# EasyEDA Pro project wifi_smart_controller.eprj

# Schematic 控制版原理图
Create Date: 2023-10-15; Page Name: P1; Project Name: smart-switch; Schematic Name: 控制版原理图; Update Date: 2023-10-21; Company: WiFi控制版; Page Size: A4; Version: V1.0
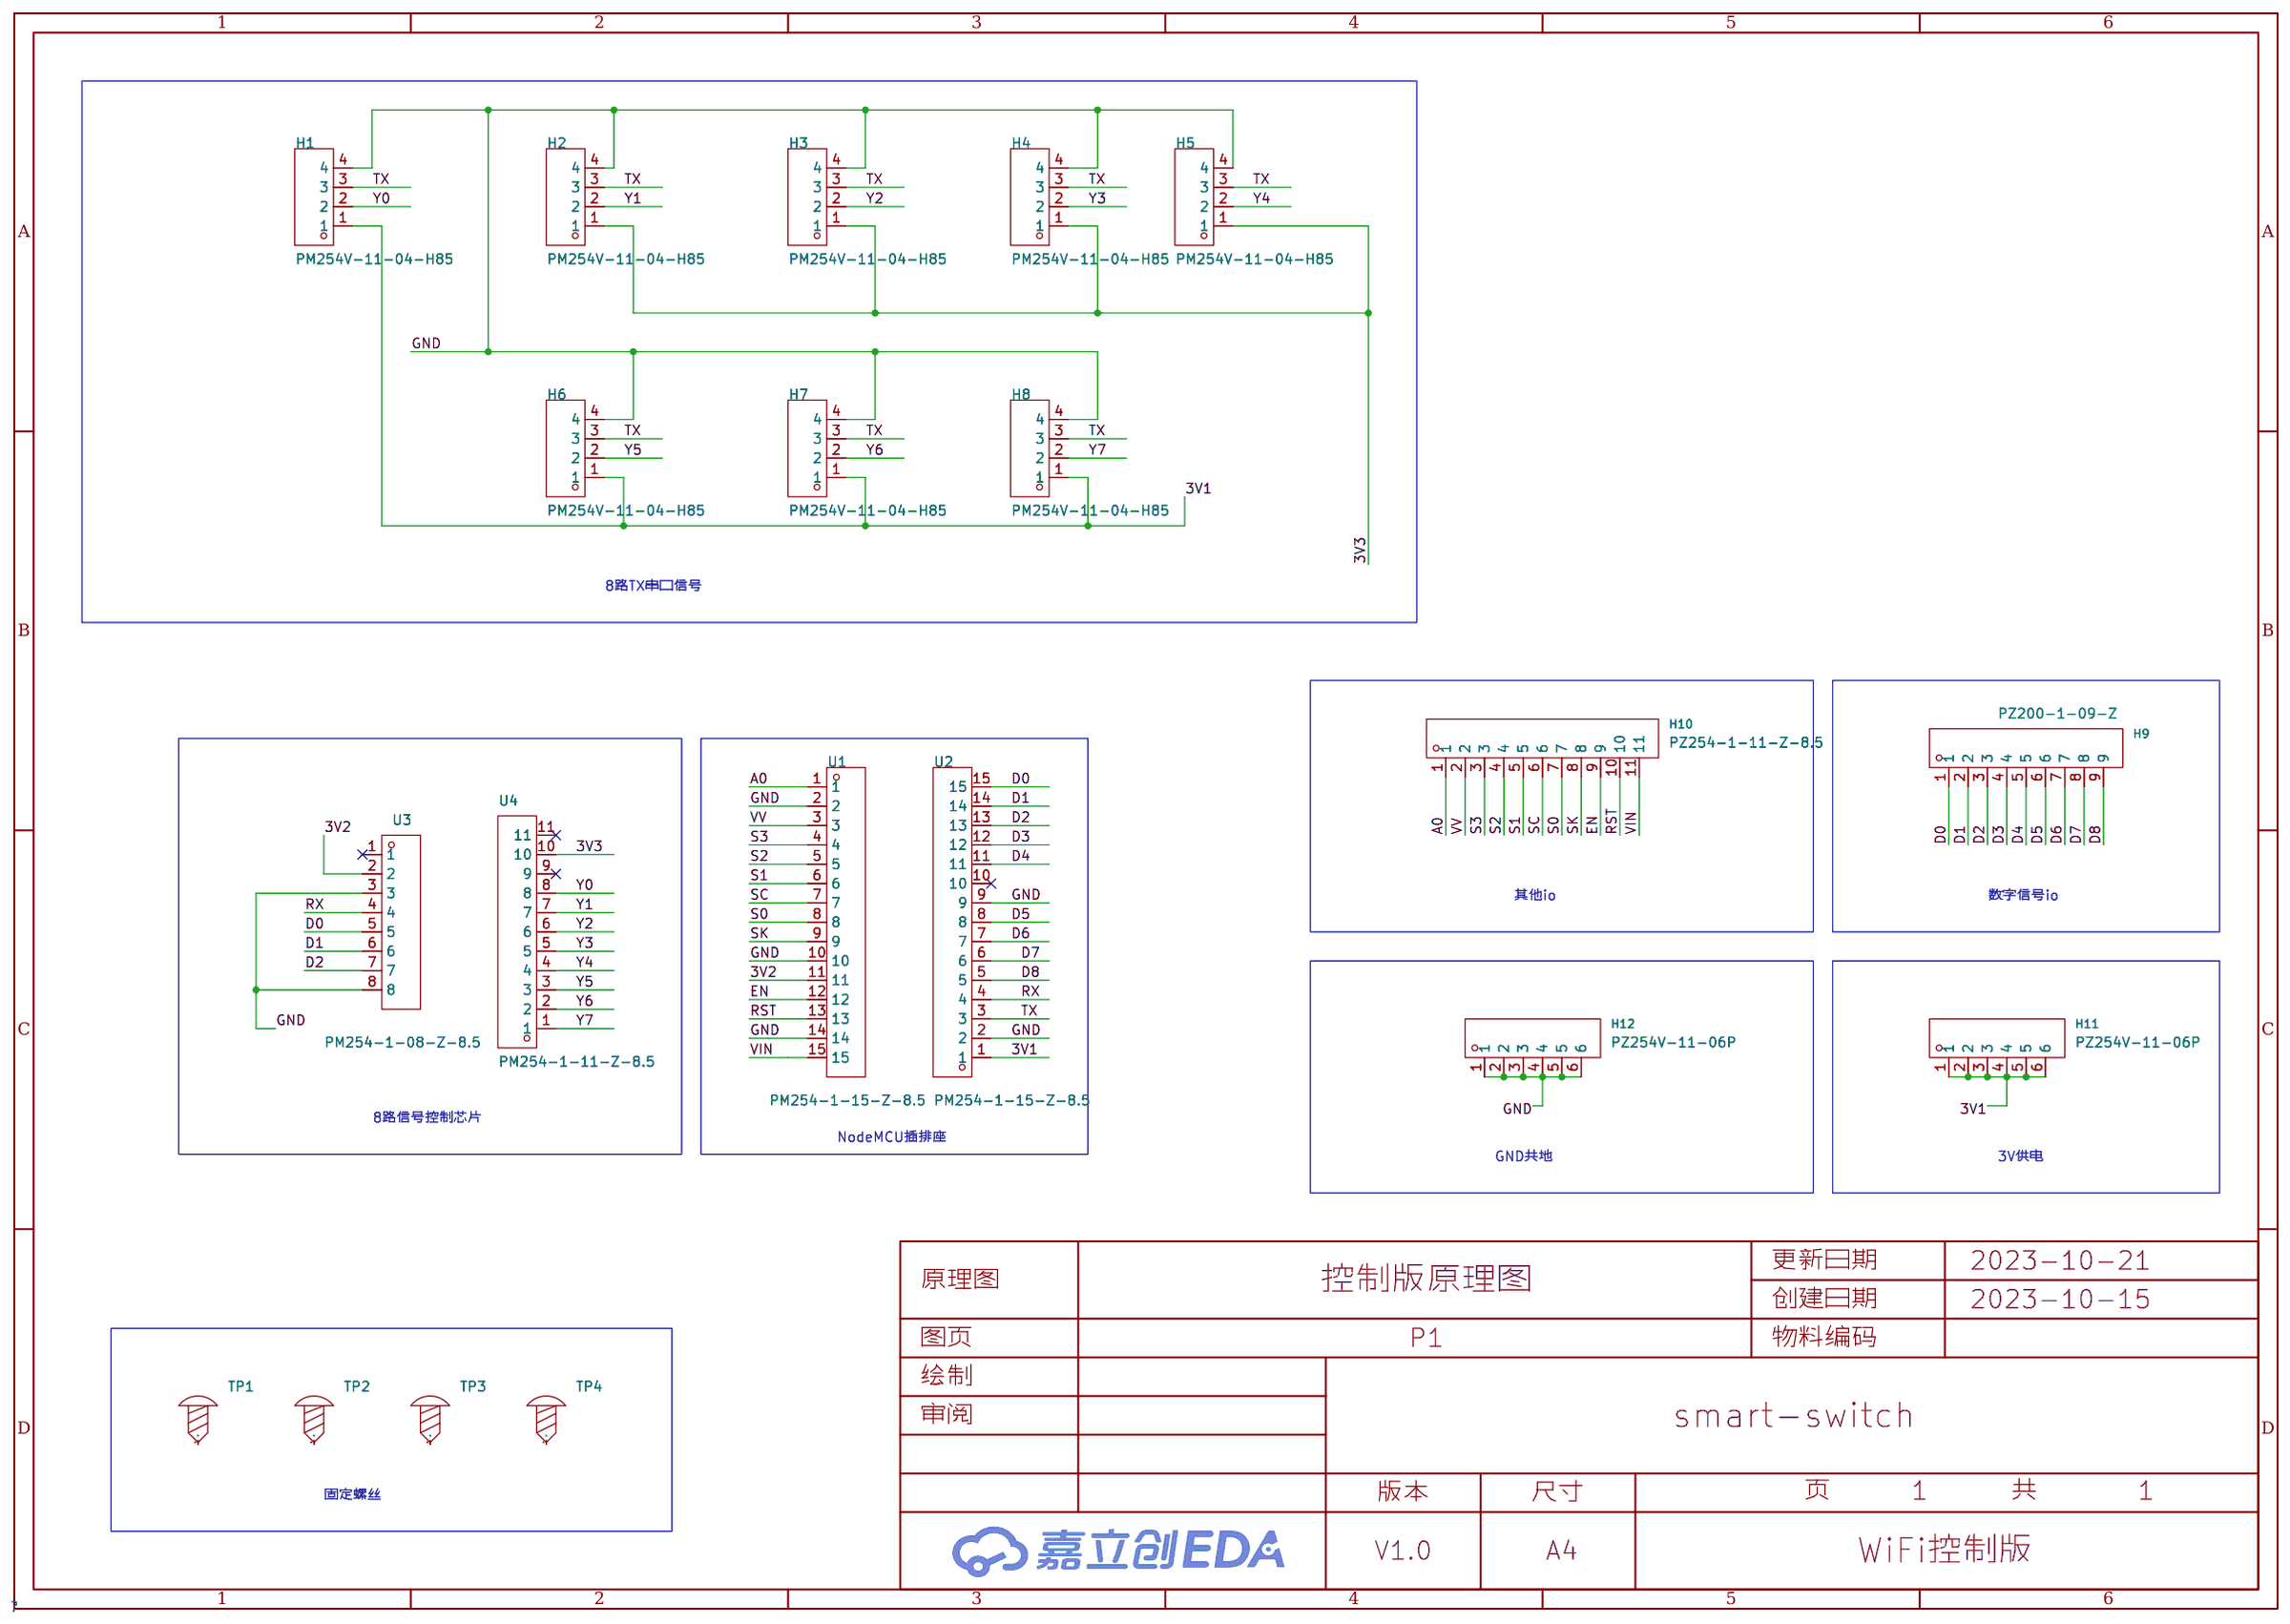
[diagram p0: schematic sheet]

## Parts
H1  PM254V-11-04-H85  [HDR-TH_4P-P2.54-V-F]
H2  PM254V-11-04-H85  [HDR-TH_4P-P2.54-V-F]
H3  PM254V-11-04-H85  [HDR-TH_4P-P2.54-V-F]
H4  PM254V-11-04-H85  [HDR-TH_4P-P2.54-V-F]
H5  PM254V-11-04-H85  [HDR-TH_4P-P2.54-V-F]
H6  PM254V-11-04-H85  [HDR-TH_4P-P2.54-V-F]
H7  PM254V-11-04-H85  [HDR-TH_4P-P2.54-V-F]
H8  PM254V-11-04-H85  [HDR-TH_4P-P2.54-V-F]
H9  PZ200-1-09-Z  [HDR-TH_9P-P2.00-V-M]
H10  PZ254-1-11-Z-8.5  [HDR-TH_11P-P2.54-V-M]
H11  PZ254V-11-06P  [HDR-TH_6P-P2.54-V-M]
H12  PZ254V-11-06P  [HDR-TH_6P-P2.54-V-M]
TP1  -  [M2螺丝]
TP2  -  [M2螺丝]
TP3  -  [M2螺丝]
TP4  -  [M2螺丝]
U1  PM254-1-15-Z-8.5  [HDR-TH_15P-P2.54-V-F]
U2  PM254-1-15-Z-8.5  [HDR-TH_15P-P2.54-V-F]
U3  PM254-1-08-Z-8.5  [HDR-TH_8P-P2.54-V-F]
U4  PM254-1-11-Z-8.5  [HDR-TH_11P-P2.54-V-F]

## Library data of the parts
H1-H8 = PM254V-11-04-H85: 排数:单排;总孔位数:4P;间距:2.54mm;插孔结构:1x4P;行距:-;安装类型:直插;塑高:-;触头材质:黄铜;触头镀层:-;; LCSC Part Name: 间距:2.54mm 1x4P 直插; Supplier Part: C541851; Manufacturer: XFCN(兴飞); Supplier Footprint: 插件,P=2.54mm; JLCPCB Part Class: 扩展库; Datasheet: https://atta.szlcsc.com/upload/public/pdf/source/20200518/C541849_85853D71FC67C51915A806977A588FDA.pdf; Supplier: LCSC; Number of Rows: 单排; Number of Holes: 4P; Pitch: 2.54mm; Holes Structure: 1x4P; Mounting Type: 直插; Contact Material: 黄铜
H9 = PZ200-1-09-Z: 排数:单排;总PIN位数:9P;间距:2mm;插针结构:1x9P;行距:-;安装类型:直插;圆针/方针:方针;额定电流:1.5A;额定电压:-;配合针长度:4mm;塑高:2mm;端接针长度:2.8mm;工作温度范围:-40℃~+105℃;颜色:黑色;; LCSC Part Name: 2mm 1x9P 直插 方针; Supplier Part: C2905955; Manufacturer: HCTL(华灿天禄); Supplier Footprint: 插件,P=2mm; JLCPCB Part Class: 扩展库; Datasheet: https://atta.szlcsc.com/upload/public/pdf/source/20230609/0DA0371628951EEB327252501352EB23.pdf; Supplier: LCSC; Number of Rows: 单排; Number of Pins: 9P; Pitch: 2mm; Pin Structure: 1x9P; Mounting Type: 直插; Circluar Pins/Square Pins: 方针; Current Rating (Max): 1.5A; Length of Mating Pin: 4mm; Insulation Height: 2mm; Length of End Connection Pin: 2.8mm; Operating Temperature Range: -40℃~+105℃; Color: 黑色
H10 = PZ254-1-11-Z-8.5: 排数:单排;总PIN位数:11;间距:2.54mm;插针结构:1x11P;行距:-;安装类型:直插;圆针/方针:方针;额定电流:3A;额定电压:-;配合针长度:6mm;塑高:2.5mm;端接针长度:3mm;触头材质:-;工作温度范围:-40℃~+105℃;颜色:黑色;; LCSC Part Name: 2.54mm 1x11P 直插 方针; Supplier Part: C2894934; Manufacturer: HCTL(华灿天禄); Supplier Footprint: 直插,P=2.54mm; JLCPCB Part Class: Extended Part; Supplier: LCSC; Number of Rows: 单排; Number of Pins: 11; Pitch: 2.54mm; Pin Structure: 1x11P; Mounting Type: 直插; Circluar Pins/Square Pins: 方针; Current Rating (Max): 3A; Length of Mating Pin: 6mm; Insulation Height: 2.5mm; Length of End Connection Pin: 3mm; Operating Temperature Range: -40℃~+105℃; Color: 黑色
H11 H12 = PZ254V-11-06P: 排数:单排;总PIN位数:6;间距:2.54mm;插针结构:1x6P;行距:-;安装类型:直插;圆针/方针:方针;额定电流:-;额定电压:-;配合针长度:6mm;塑高:2.5mm;端接针长度:3mm;触头材质:黄铜;触头镀层:-;工作温度范围:-40℃~+105℃;颜色:黑色;; LCSC Part Name: 2.54mm 1x6P 直插 方针; Supplier Part: C492405; Manufacturer: XFCN(兴飞); Supplier Footprint: 直插,P=2.54mm; JLCPCB Part Class: Extended Part; Supplier: LCSC; Number of Rows: 单排; Number of Pins: 6; Pitch: 2.54mm; Pin Structure: 1x6P; Mounting Type: 直插; Circluar Pins/Square Pins: 方针; Length of Mating Pin: 6mm; Insulation Height: 2.5mm; Length of End Connection Pin: 3mm; Contact Material: 黄铜; Operating Temperature Range: -40℃~+105℃; Color: 黑色
TP1-TP4 = M2螺丝: Supplier Footprint: 插件
U1 U2 = PM254-1-15-Z-8.5: 排数:单排;总孔位数:15P;间距:2.54mm;插孔结构:1x15P;行距:-;安装类型:直插;圆孔/方孔:方孔;额定电流:3A;额定电压:-;插孔方向:顶部;塑高:8.5mm;工作温度范围:-40℃~+105℃;; LCSC Part Name: 间距:2.54mm 1x15P 直插; Supplier Part: C2897378; Manufacturer: HCTL(华灿天禄); Supplier Footprint: 插件,P=2.54mm; JLCPCB Part Class: 扩展库; Datasheet: https://atta.szlcsc.com/upload/public/pdf/source/20230609/534BE42964C679BDE98E061007C4ABD6.pdf; Supplier: LCSC; Number of Rows: 单排; Number of Holes: 15P; Pitch: 2.54mm; Holes Structure: 1x15P; Mounting Type: 直插; Circular Hole / Square Hole: 方孔; Current Rating (Max): 3A; Holes Direction: 顶部; Insulation Height: 8.5mm; Operating Temperature Range: -40℃~+105℃
U3 = PM254-1-08-Z-8.5: 排数:单排;总孔位数:8P;间距:2.54mm;插孔结构:1x8P;行距:-;安装类型:直插;圆孔/方孔:方孔;额定电流:3A;额定电压:-;插孔方向:顶部;塑高:8.5mm;工作温度范围:-40℃~+105℃;; LCSC Part Name: 间距:2.54mm 1x8P 直插; Supplier Part: C2897371; Manufacturer: HCTL(华灿天禄); Supplier Footprint: 插件,P=2.54mm; JLCPCB Part Class: Extended Part; Datasheet: https://atta.szlcsc.com/upload/public/pdf/source/20230609/534BE42964C679BDE98E061007C4ABD6.pdf; Supplier: LCSC; Number of Rows: 单排; Number of Holes: 8P; Pitch: 2.54mm; Holes Structure: 1x8P; Mounting Type: 直插; Circular Hole / Square Hole: 方孔; Current Rating (Max): 3A; Holes Direction: 顶部; Insulation Height: 8.5mm; Operating Temperature Range: -40℃~+105℃
U4 = PM254-1-11-Z-8.5: 排数:单排;总孔位数:11P;间距:2.54mm;插孔结构:1x11P;行距:-;安装类型:直插;圆孔/方孔:方孔;额定电流:3A;额定电压:-;插孔方向:顶部;塑高:8.5mm;工作温度范围:-40℃~+105℃;; LCSC Part Name: 间距:2.54mm 1x11P 直插; Supplier Part: C2897374; Manufacturer: HCTL(华灿天禄); Supplier Footprint: 插件,P=2.54mm; JLCPCB Part Class: 扩展库; Datasheet: https://atta.szlcsc.com/upload/public/pdf/source/20230609/534BE42964C679BDE98E061007C4ABD6.pdf; Supplier: LCSC; Number of Rows: 单排; Number of Holes: 11P; Pitch: 2.54mm; Holes Structure: 1x11P; Mounting Type: 直插; Circular Hole / Square Hole: 方孔; Current Rating (Max): 3A; Holes Direction: 顶部; Insulation Height: 8.5mm; Operating Temperature Range: -40℃~+105℃

## Nets
3V1: H1.1 H6.1 H7.1 H8.1 H11.1 H11.2 H11.3 H11.4 H11.5 H11.6 U2.1
3V2: U1.11 U3.2
3V3: H2.1 H3.1 H4.1 H5.1 U4.10
GND: H1.4 H2.4 H3.4 H4.4 H5.4 H6.4 H7.4 H8.4 H12.1 H12.2 H12.3 H12.4 H12.5 H12.6 U1.2 U1.10 U1.14 U2.2 U2.9 U3.3 U3.8
VIN: H10.11 U1.15
A0: H10.1 U1.1
D0: H9.1 U2.15 U3.5
D1: H9.2 U2.14 U3.6
D2: H9.3 U2.13 U3.7
D3: H9.4 U2.12
D4: H9.5 U2.11
D5: H9.6 U2.8
D6: H9.7 U2.7
D7: H9.8 U2.6
D8: H9.9 U2.5
EN: H10.9 U1.12
RST: H10.10 U1.13
RX: U2.4 U3.4
S0: H10.7 U1.8
S1: H10.5 U1.6
S2: H10.4 U1.5
S3: H10.3 U1.4
SC: H10.6 U1.7
SK: H10.8 U1.9
TX: H1.3 H2.3 H3.3 H4.3 H5.3 H6.3 H7.3 H8.3 U2.3
VV: H10.2 U1.3
Y0: H1.2 U4.8
Y1: H2.2 U4.7
Y2: H3.2 U4.6
Y3: H4.2 U4.5
Y4: H5.2 U4.4
Y5: H6.2 U4.3
Y6: H7.2 U4.2
Y7: H8.2 U4.1

Not connected (* = marked no-connect by the designer): TP1 1; TP2 1; TP3 1; TP4 1; U2 10*; U3 1*; U4 9* 11*

## Notes on the sheet
- 8路TX串口信号
- 其他io
- 数字信号io
- 8路信号控制芯片
- NodeMCU插排座
- GND共地
- 3V供电
- 固定螺丝

# Board PCB1
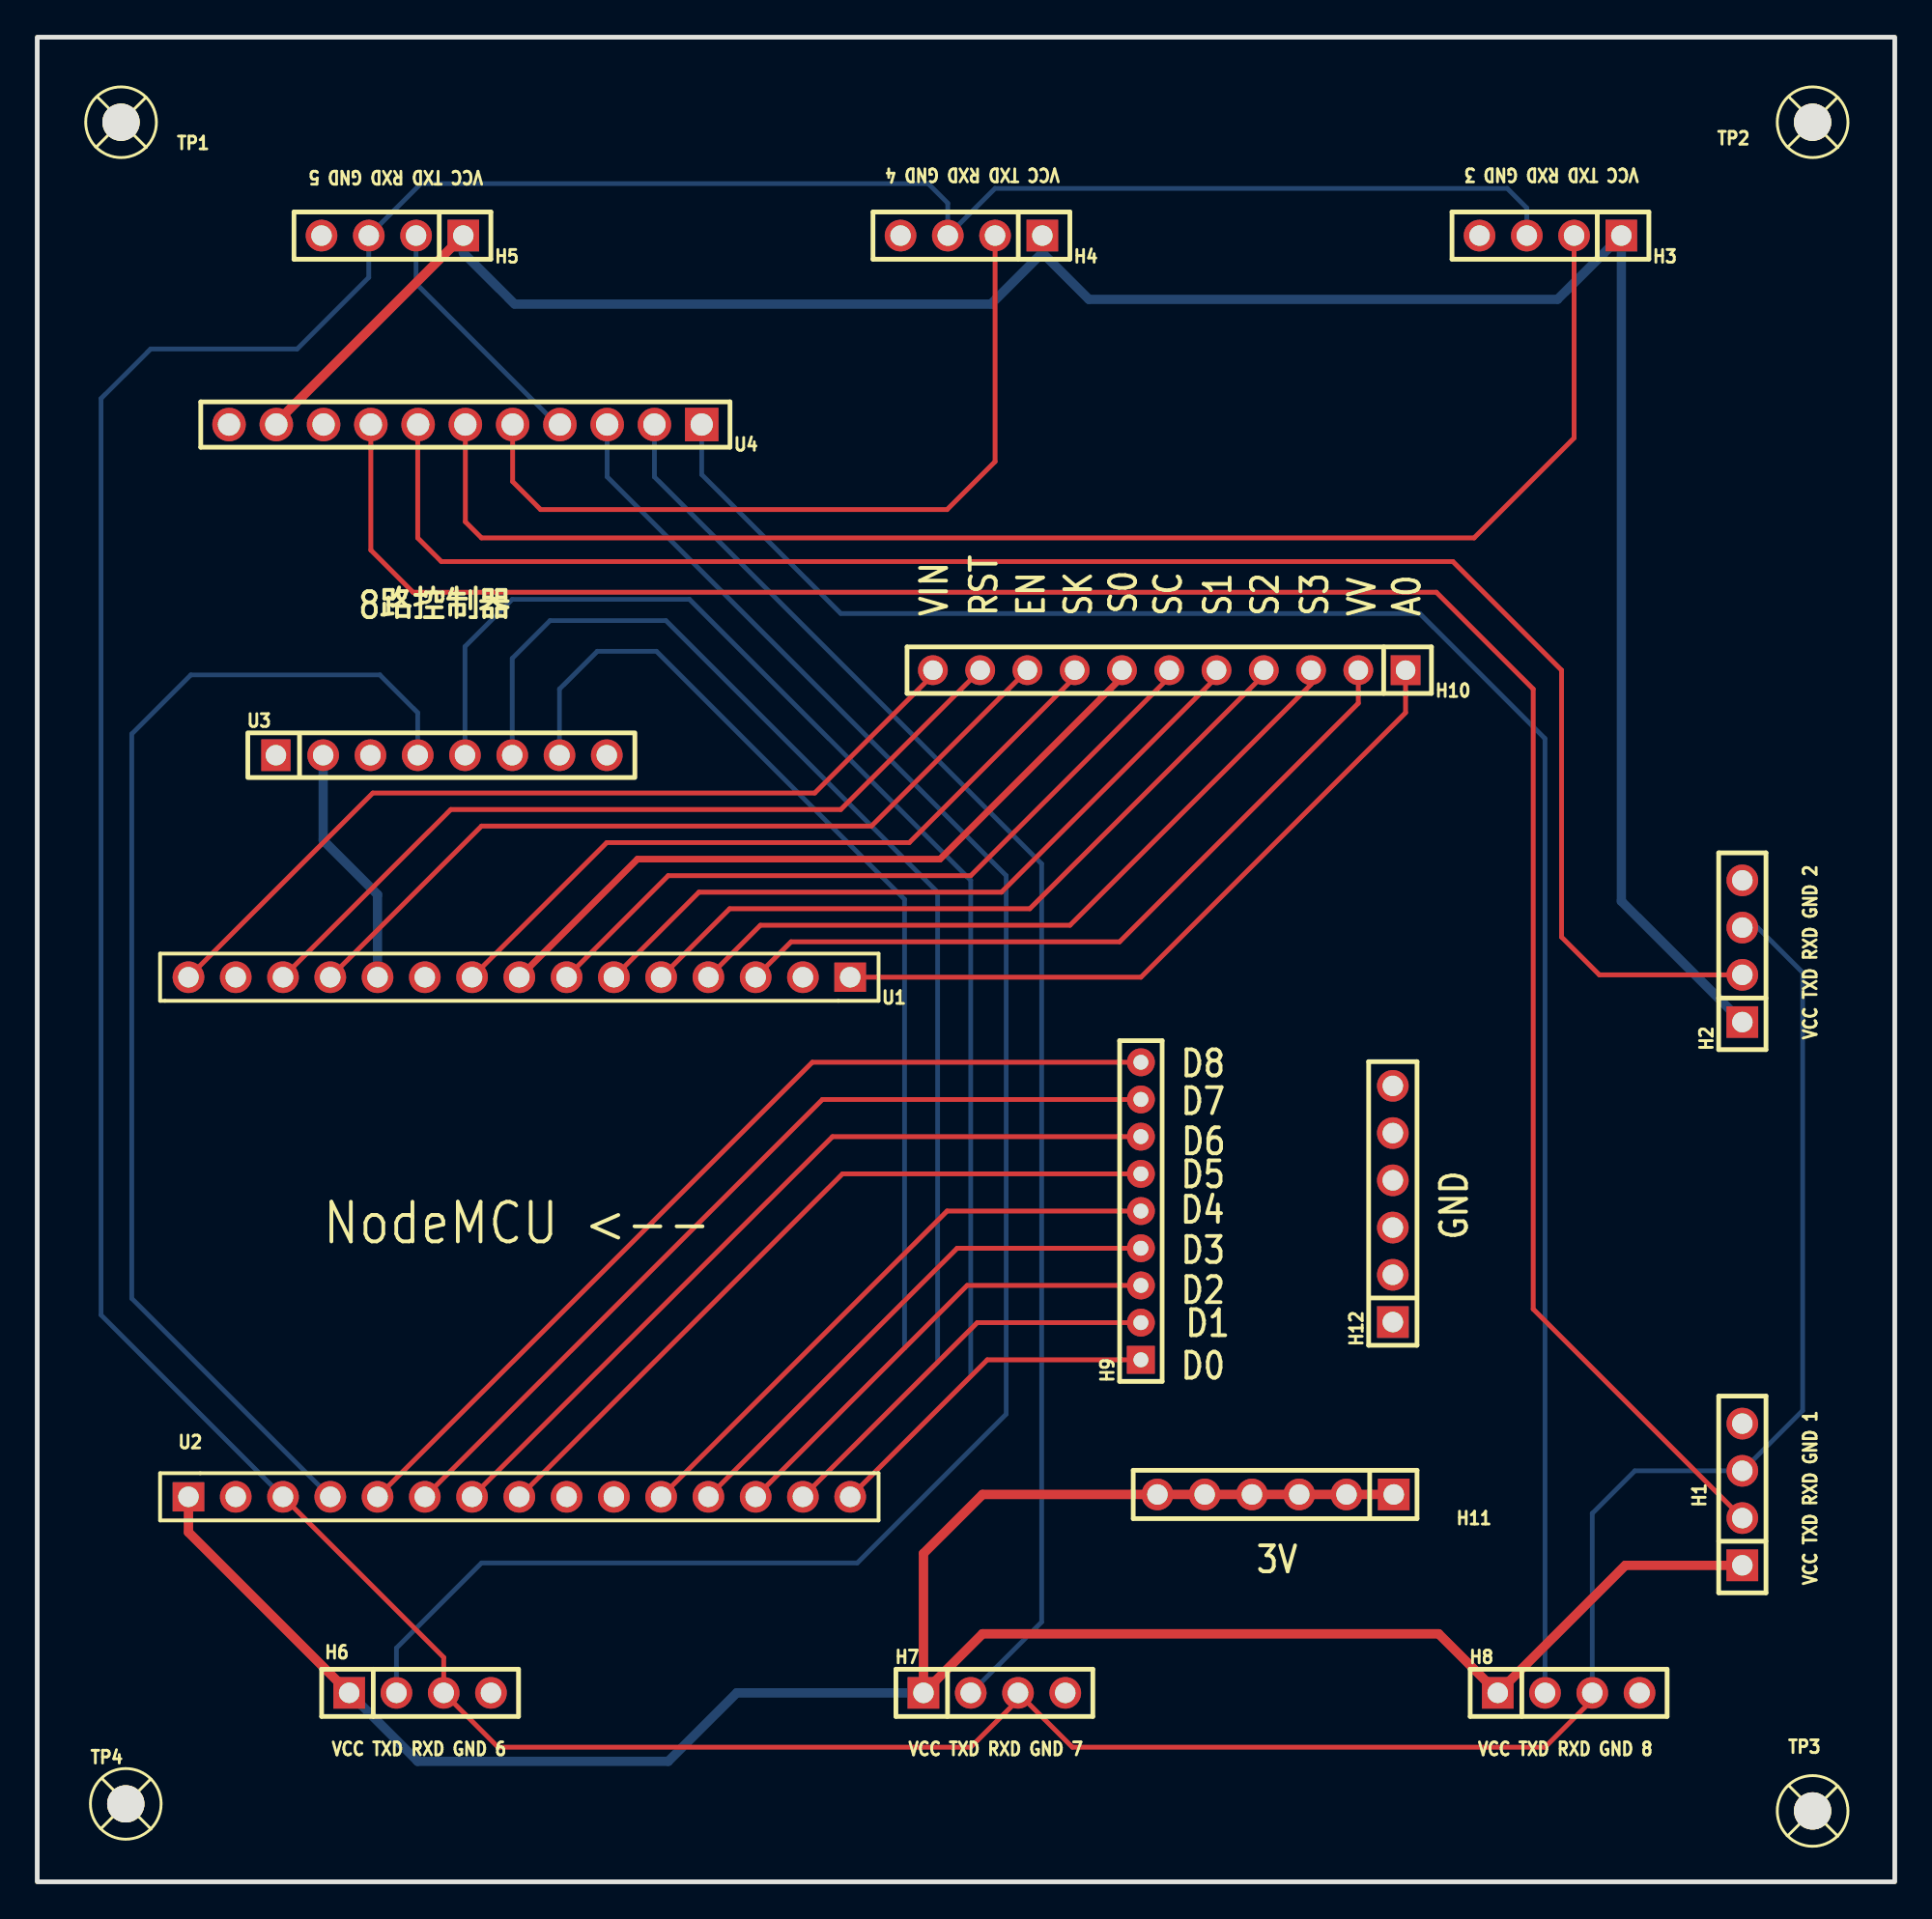
[diagram p1: board, top side]
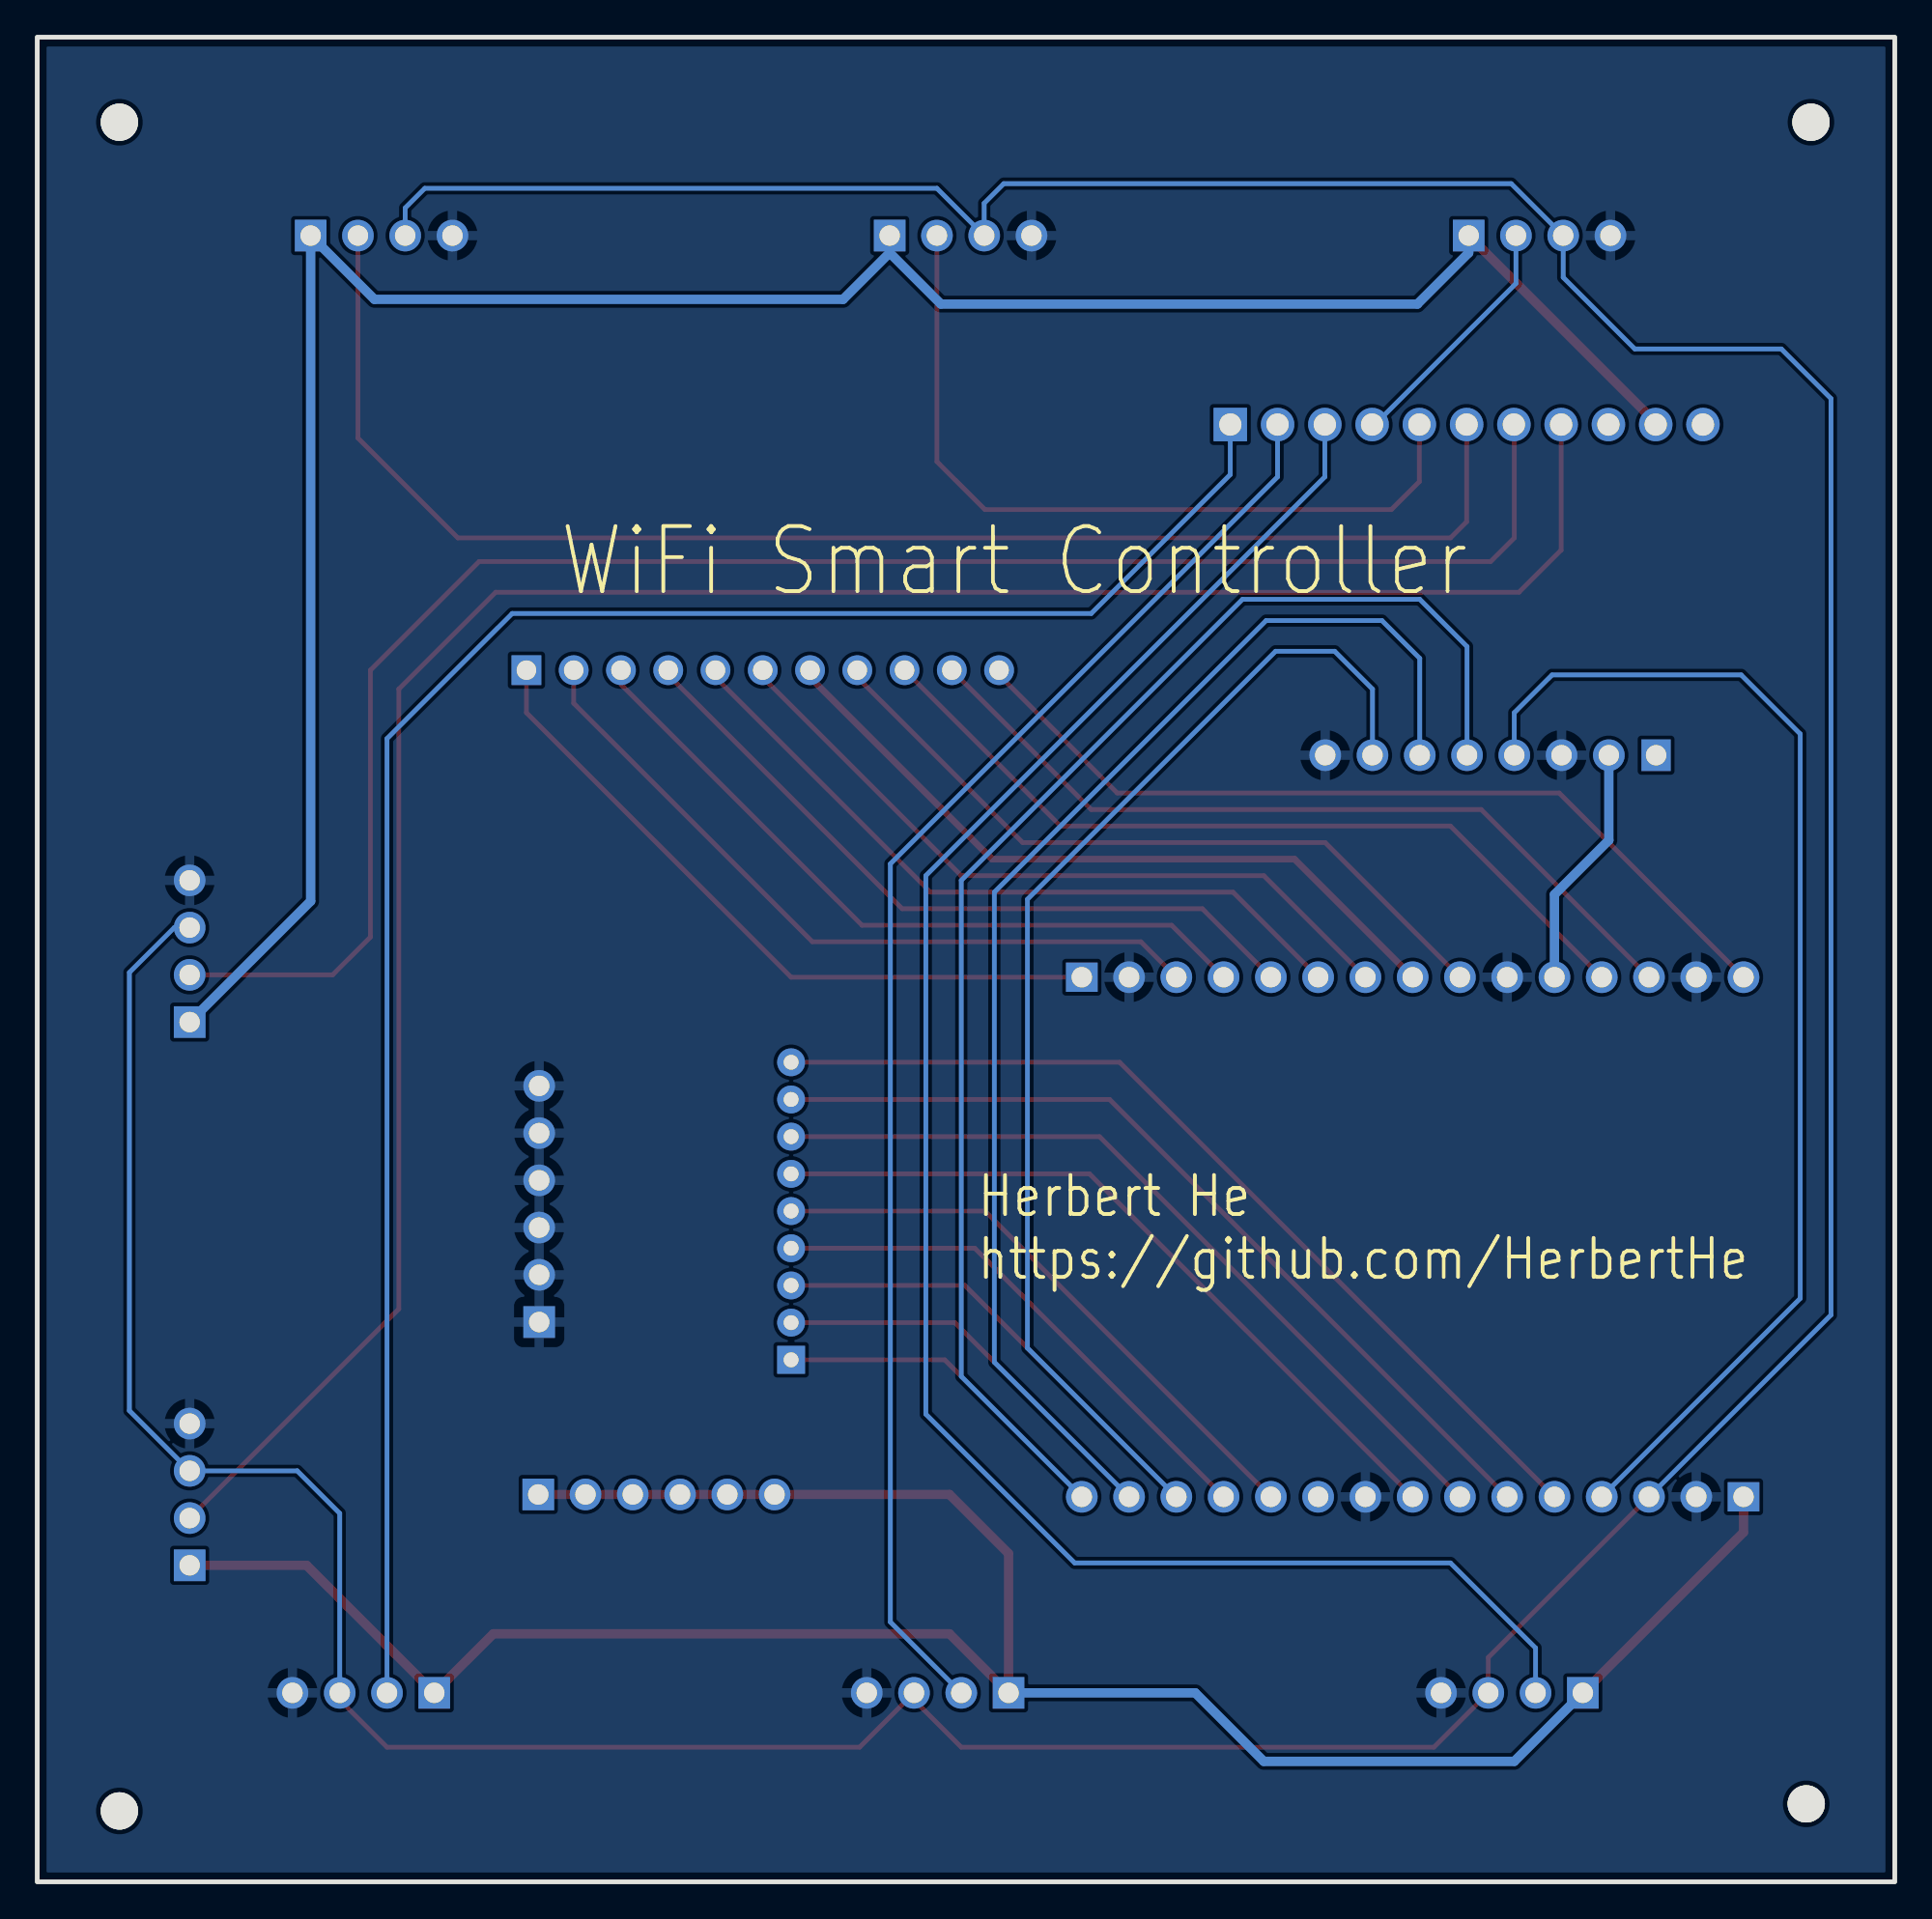
[diagram p2: board, bottom side, seen from below]

Outline 99.82 x 99.19 mm; copper layers: Top Layer, Bottom Layer. Coordinates in mm from the lower left corner of the outline.
Outline path: rectangle 0,99.19 99.82,0
Stack: Top Layer 0.035mm / Dielectric1 1.51mm FR4 er 4.5 / Bottom Layer 0.035mm

## Design rules (mm)
template: JLCPCB Capability(Two Layers Board)
spacing copperThickness1oz (default): track to track 0.102, other pairs 0.152 to 0.3
spacing copperThickness2oz: track to track 0.203, other pairs 0.152 to 0.3
track width copperThickness1oz (default): min 0.127, default 0.254, max 2.54
track width copperThickness2oz: min 0.203, default 0.254, max 2.54
differential pair differentialPair (default): width min 0.127, default 0.254, max 2.54; gap min 0.152, default 0.152
via viaSize (default): diameter min 0.5, default 0.61, max 10; hole min 0.3, default 0.305, max 6.3

## Placement (name value [footprint] x y rotation side)
H1  PM254V-11-04-H85  [HDR-TH_4P-P2.54-V-F]  91.63 20.83 90 top
H2  PM254V-11-04-H85  [HDR-TH_4P-P2.54-V-F]  91.63 50.04 90 top
H3  PM254V-11-04-H85  [HDR-TH_4P-P2.54-V-F]  81.32 88.52 180 top
H4  PM254V-11-04-H85  [HDR-TH_4P-P2.54-V-F]  50.2 88.52 180 top
H5  PM254V-11-04-H85  [HDR-TH_4P-P2.54-V-F]  19.09 88.52 180 top
H6  PM254V-11-04-H85  [HDR-TH_4P-P2.54-V-F]  20.57 10.16 0 top
H7  PM254V-11-04-H85  [HDR-TH_4P-P2.54-V-F]  51.44 10.16 0 top
H8  PM254V-11-04-H85  [HDR-TH_4P-P2.54-V-F]  82.3 10.16 0 top
H9  PZ200-1-09-Z  [HDR-TH_9P-P2.00-V-M]  59.31 36.07 90 top
H10  PZ254-1-11-Z-8.5  [HDR-TH_11P-P2.54-V-M]  60.83 65.15 180 top
H11  PZ254V-11-06P  [HDR-TH_6P-P2.54-V-M]  66.55 20.83 180 top
H12  PZ254V-11-06P  [HDR-TH_6P-P2.54-V-M]  72.85 36.45 90 top
TP1  -  [M2螺丝]  4.51 94.62 0 top
TP2  -  [M2螺丝]  95.41 94.62 0 top
TP3  -  [M2螺丝]  95.41 3.81 0 top
TP4  -  [M2螺丝]  4.76 4.19 0 top
U1  PM254-1-15-Z-8.5  [HDR-TH_15P-P2.54-V-F]  25.91 48.64 180 top
U2  PM254-1-15-Z-8.5  [HDR-TH_15P-P2.54-V-F]  25.91 20.7 0 top
U3  PM254-1-08-Z-8.5  [HDR-TH_8P-P2.54-V-F]  21.72 60.58 0 top
U4  PM254-1-11-Z-8.5  [HDR-TH_11P-P2.54-V-F]  23.01 78.36 180 top

## Footprints (pads in the part's own frame, mm; a bottom-side part is the same pattern mirrored in y, then rotated)
HDR-TH_4P-P2.54-V-F
  rect 1.7x1.7 hole 1.1: 1(-3.81,0)
  round 1.7 hole 1.1: 2(-1.27,0) 3(1.27,0) 4(3.81,0)
HDR-TH_6P-P2.54-V-M
  rect 1.7x1.7 hole 1.1: 1(-6.35,0)
  round 1.7 hole 1.1: 2(-3.81,0) 3(-1.27,0) 4(1.27,0) 5(3.81,0) 6(6.35,0)
HDR-TH_8P-P2.54-V-F
  rect 1.575x1.7 hole 1.1: 1(-8.89,0)
  round 1.7 hole 1.1: 2(-6.35,0) 3(-3.81,0) 4(-1.27,0) 5(1.27,0) 6(3.81,0) 7(6.35,0) 8(8.89,0)
HDR-TH_9P-P2.00-V-M
  rect 1.5x1.5 hole 0.8: 1(-8,0)
  round 1.5 hole 0.8: 2(-6,0) 3(-4,0) 4(-2,0) 5(0,0) 6(2,0) 7(4,0) 8(6,0) 9(8,0)
HDR-TH_11P-P2.54-V-F
  rect 1.8x1.8 hole 1.2: 1(-12.7,0)
  round 1.8 hole 1.2: 2(-10.16,0) 3(-7.62,0) 4(-5.08,0) 5(-2.54,0) 6(0,0) 7(2.54,0) 8(5.08,0) 9(7.62,0) 10(10.16,0) 11(12.7,0)
HDR-TH_11P-P2.54-V-M
  rect 1.6x1.6 hole 1.05: 1(-12.7,0)
  round 1.6 hole 1.05: 2(-10.16,0) 3(-7.62,0) 4(-5.08,0) 5(-2.54,0) 6(0,0) 7(2.54,0) 8(5.08,0) 9(7.62,0) 10(10.16,0) 11(12.7,0)
HDR-TH_15P-P2.54-V-F
  rect 1.7x1.575 hole 1.1: 1(-17.78,0)
  round 1.7 hole 1.1: 2(-15.24,0) 3(-12.7,0) 4(-10.16,0) 5(-7.62,0) 6(-5.08,0) 7(-2.54,0) 8(0,0) 9(2.54,0) 10(5.08,0) 11(7.62,0) 12(10.16,0) 13(12.7,0) 14(15.24,0) 15(17.78,0)
M2螺丝
  round 2 hole 2: 1(0,0)

## Nets
As in the schematic.

Pads without a net: TP1 1; TP2 1; TP3 1; TP4 1; U2 10; U3 1; U4 9 11

## Routing (per net, layer and track width the routed paths; a pad name or vN(x,y) marks a point on that pad's centre or on a via; arc(x,y) is an arc through that point)
3V1: length 131.6
  Top Layer w0.5: 16.76,10.16 8.13,18.8 U2.1 ; H1.1 85.34,17.02 H8.1 75.31,13.34 50.8,13.34 H7.1 47.63,17.65 50.8,20.83 H11.5 H11.4 H11.2 H11.1
  Bottom Layer w0.5: H7.1 37.59,10.16 33.91,6.48 20.45,6.48 16.76,10.16
3V2: length 13.1
  Bottom Layer w0.5: 18.29,48.64 18.29,53.09 15.37,56.01 U3.2
3V3: length 128.1
  Top Layer w0.5: U4.10 12.85,78.47 H5.1
  Bottom Layer w0.5: 54.01,87.59 51.26,84.84 25.65,84.84 22.9,87.59 H5.1 ; 54.01,87.59 56.52,85.09 81.7,85.09 H3.1 85.13,52.73 H2.1 ; 54.01,87.59 H4.1
VIN: length 47
  Top Layer w0.254: H10.11 48.13,64.9 41.78,58.55 18.03,58.55 U1.15
A0: length 38
  Top Layer w0.254: H10.1 73.53,62.87 59.31,48.64 U1.1
D0: length 94.8
  Top Layer w0.254: U2.15 51.05,28.07 H9.1
  Bottom Layer w0.254: U3.5 22.99,66.42 25.53,68.96 35.05,68.96 50.17,53.85 50.17,27.18 U2.15
D1: length 92.5
  Top Layer w0.254: U2.14 50.52,30.07 H9.2
  Bottom Layer w0.254: U3.6 25.53,65.79 27.56,67.82 33.78,67.82 48.39,53.21 48.39,27.94 U2.14
D2: length 89.3
  Top Layer w0.254: 38.61,20.7 49.98,32.07 H9.3
  Bottom Layer w0.254: U3.7 28.07,64.14 30.1,66.17 33.27,66.17 46.61,52.83 46.61,28.7 38.61,20.7
D3: length 28.8
  Top Layer w0.254: H9.4 49.44,34.07 U2.12
D4: length 32.1
  Top Layer w0.254: H9.5 48.89,36.07 U2.11
D5: length 40.6
  Top Layer w0.254: U2.8 43.27,38.07 H9.6
D6: length 44
  Top Layer w0.254: H9.7 42.73,40.07 23.37,20.7
D7: length 47.3
  Top Layer w0.254: H9.8 42.2,42.07 U2.6
D8: length 50.7
  Top Layer w0.254: H9.9 41.66,44.07 18.29,20.7
EN: length 44.3
  Top Layer w0.254: U1.12 23.88,56.77 44.83,56.77 H10.9
RST: length 44.3
  Top Layer w0.254: H10.10 43.18,57.66 22.23,57.66 U1.13
RX: length 65.2
  Bottom Layer w0.254: U3.4 20.45,62.87 18.42,64.9 8.26,64.9 5.08,61.72 5.08,31.37 U2.4
S0: length 39.4
  Top Layer w0.354: H10.7 58.29,64.77 48.51,54.99 32.26,54.99 U1.8
S1: length 39.4
  Top Layer w0.254: U1.6 35.56,53.21 51.82,53.21 63.37,64.77 H10.5
S2: length 39.4
  Top Layer w0.254: H10.4 65.91,64.9 53.34,52.32 37.21,52.32 U1.5
S3: length 39.7
  Top Layer w0.254: U1.4 38.86,51.44 55.5,51.44 68.45,64.39 H10.3
SC: length 39.4
  Top Layer w0.254: H10.6 60.83,64.77 50.17,54.1 33.91,54.1 U1.7
SK: length 39.4
  Top Layer w0.254: 23.37,48.64 30.61,55.88 46.86,55.88 55.75,64.77 H10.8
TX: length 283.1
  Top Layer w0.254: H8.3 83.57,9.78 81.03,7.24 55.63,7.24 H7.3 52.7,9.78 50.17,7.24 24.77,7.24 21.84,10.16 21.84,12.06 U2.3
  Bottom Layer w0.254: H2.3 92.46,51.31 94.87,48.9 94.87,25.34 H1.3 85.85,22.1 83.57,19.81 H8.3 ; U2.3 3.43,30.48 3.43,79.76 6.1,82.42 13.97,82.42 17.82,86.27 17.82,88.52 20.61,91.31 47.88,91.31 48.93,90.26 H4.3 51.47,91.06 78.99,91.06 80.05,90.01 80.05,88.52
VV: length 40.3
  Top Layer w0.254: 38.61,48.64 40.51,50.55 58.17,50.55 70.99,63.37 H10.2
Y0: length 121.5
  Top Layer w0.254: U4.8 17.93,71.61 20.19,69.34 75.18,69.34 80.39,64.14 80.39,30.8 91.63,19.56
Y1: length 95.4
  Top Layer w0.254: H2.2 83.95,48.77 81.92,50.8 81.92,65.15 76.07,70.99 21.72,70.99 20.45,72.26 20.45,78.34 U4.7
Y2: length 78.3
  Top Layer w0.254: H3.2 82.59,77.64 77.22,72.26 23.88,72.26 23.01,73.13 U4.6
Y3: length 42.8
  Top Layer w0.254: U4.5 25.55,75.29 27.05,73.79 48.89,73.79 51.47,76.37 H4.2
Y4: length 13.4
  Bottom Layer w0.254: H5.2 20.36,85.94 27.94,78.36 U4.4
Y5: length 102.5
  Bottom Layer w0.254: H6.2 19.3,12.57 23.88,17.15 44.07,17.15 52.07,25.15 52.07,54.1 30.63,75.54 U4.3
Y6: length 78.4
  Bottom Layer w0.254: U4.2 33.17,75.54 53.98,54.74 53.98,13.97 H7.2
Y7: length 105.2
  Bottom Layer w0.254: U4.1 35.71,75.67 43.18,68.2 74.3,68.2 81.03,61.47 H8.2

## Copper pours and planes (outline as drawn; the poured copper is in the pictures)
GND on Bottom Layer: 0.26,99.19 100.33,99.19 100.33,0.25 0.26,0.25

## Text on the board
Bottom Silkscreen Layer: Herbert He / https://github.com/HerbertHe | WiFi Smart Controller
Top Silkscreen Layer: VCC TXD RXD GND 6 | VCC TXD RXD GND 7 | VCC TXD RXD GND 8 | VCC TXD RXD GND 2 | VCC TXD RXD GND 1 | VCC TXD RXD GND 5 | VCC TXD RXD GND 4 | VCC TXD RXD GND 3 | D4 | D8 | D7 | D5 | D3 | D2 | D0 | D6 | D1 | RST | EN | SK | S0 | SC | S1 | S2 | S3 | A0 | GND | 3V | VIN | VV | NodeMCU <-- | 8路控制器
